# EAGLE design sboxs (EAGLE 8.6.0)
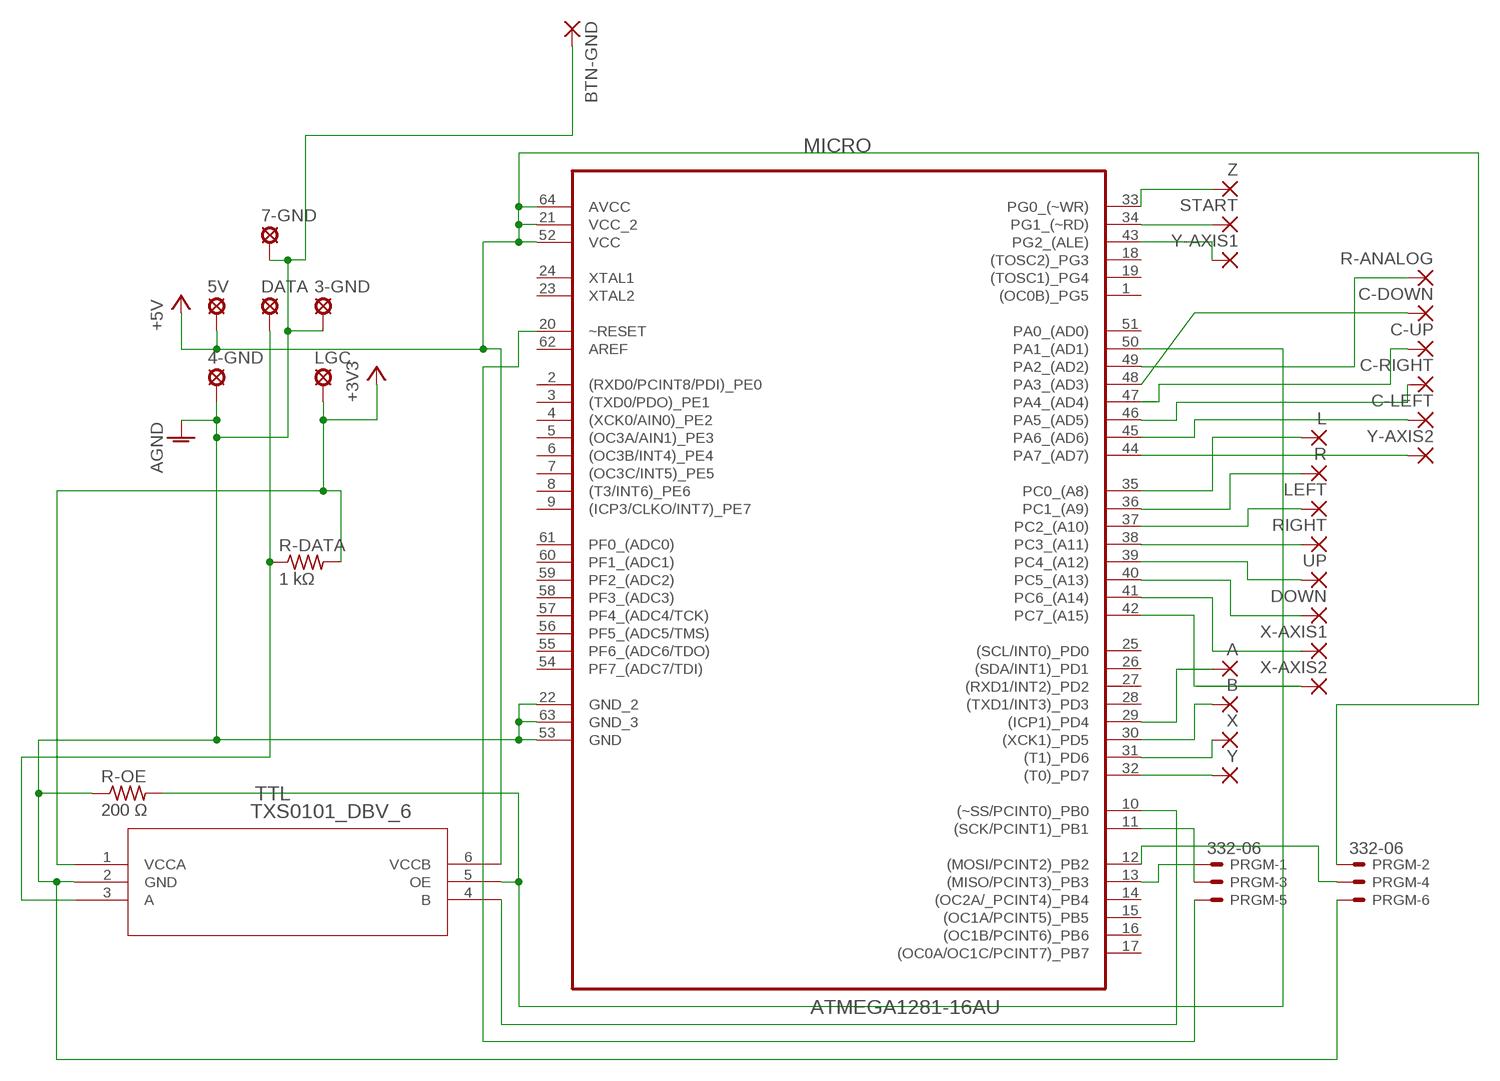
[diagram p0: schematic, sheet 1]

## Parts
3-GND  LSP10  [LSP10]
4-GND  LSP10  [LSP10]
5V  LSP10  [LSP10]
7-GND  LSP10  [LSP10]
A  1,6/0,8  [1,6/0,8]
B  1,6/0,8  [1,6/0,8]
BTN-GND  1,6/0,8  [1,6/0,8]
C-DOWN  1,6/0,8  [1,6/0,8]
C-LEFT  1,6/0,8  [1,6/0,8]
C-RIGHT  1,6/0,8  [1,6/0,8]
C-UP  1,6/0,8  [1,6/0,8]
DATA  LSP10  [LSP10]
DOWN  1,6/0,8  [1,6/0,8]
L  1,6/0,8  [1,6/0,8]
LEFT  1,6/0,8  [1,6/0,8]
LGC  LSP10  [LSP10]
MICRO  ATMEGA1281-16AU  [QFP80P1600X1600X120-64N]
PRGM  332-06  [332-06]
R  1,6/0,8  [1,6/0,8]
R-ANALOG  1,6/0,8  [1,6/0,8]
R-DATA  1 kΩ  R-US_0207/12  [0207/12]
R-OE  200 Ω  R-US_0207/12  [0207/12]
RIGHT  1,6/0,8  [1,6/0,8]
START  1,6/0,8  [1,6/0,8]
TTL  TXS0101_DBV_6  [DBV6]
UP  1,6/0,8  [1,6/0,8]
X  1,6/0,8  [1,6/0,8]
X-AXIS1  1,6/0,8  [1,6/0,8]
X-AXIS2  1,6/0,8  [1,6/0,8]
Y  1,6/0,8  [1,6/0,8]
Y-AXIS1  1,6/0,8  [1,6/0,8]
Y-AXIS2  1,6/0,8  [1,6/0,8]
Z  1,6/0,8  [1,6/0,8]

## Nets
+3V3: LGC.MP R-DATA.2 TTL.1(VCCA)
+5V: 5V.MP MICRO.21(VCC_2) MICRO.52(VCC) MICRO.64(AVCC) PRGM.2 TTL.6(VCCB)
AGND: 3-GND.MP 4-GND.MP 7-GND.MP BTN-GND.1(P) MICRO.22(GND_2) MICRO.53(GND) MICRO.63(GND_3) PRGM.6 R-OE.1 TTL.2(GND)
N$1: MICRO.32((T0)_PD7) Y.1(P)
N$2: MICRO.31((T1)_PD6) X.1(P)
N$3: B.1(P) MICRO.30((XCK1)_PD5)
N$4: A.1(P) MICRO.29((ICP1)_PD4)
N$5: MICRO.33(PG0_(~WR)) Z.1(P)
N$6: MICRO.34(PG1_(~RD)) START.1(P)
N$7: L.1(P) MICRO.35(PC0_(A8))
N$8: MICRO.36(PC1_(A9)) R.1(P)
N$9: LEFT.1(P) MICRO.37(PC2_(A10))
N$10: MICRO.38(PC3_(A11)) RIGHT.1(P)
N$11: MICRO.39(PC4_(A12)) UP.1(P)
N$12: DOWN.1(P) MICRO.40(PC5_(A13))
N$13: MICRO.41(PC6_(A14)) X-AXIS1.1(P)
N$14: MICRO.42(PC7_(A15)) X-AXIS2.1(P)
N$15: MICRO.44(PA7_(AD7)) Y-AXIS2.1(P)
N$16: C-LEFT.1(P) MICRO.45(PA6_(AD6))
N$17: C-RIGHT.1(P) MICRO.46(PA5_(AD5))
N$18: C-UP.1(P) MICRO.47(PA4_(AD4))
N$19: C-DOWN.1(P) MICRO.48(PA3_(AD3))
N$20: MICRO.49(PA2_(AD2)) R-ANALOG.1(P)
N$21: MICRO.13((MISO/PCINT3)_PB3) PRGM.1
N$22: MICRO.12((MOSI/PCINT2)_PB2) PRGM.4
N$23: MICRO.11((SCK/PCINT1)_PB1) PRGM.3
N$24: MICRO.43(PG2_(ALE)) Y-AXIS1.1(P)
N$25: MICRO.20(~RESET) PRGM.5
N$28: DATA.MP R-DATA.1 TTL.3(A)
N$29: MICRO.10((~SS/PCINT0)_PB0) TTL.4(B)
N$30: MICRO.50(PA1_(AD1)) R-OE.2 TTL.5(OE)
Unconnected: MICRO.1((OC0B)_PG5) MICRO.2((RXD0/PCINT8/PDI)_PE0) MICRO.3((TXD0/PDO)_PE1) MICRO.4((XCK0/AIN0)_PE2) MICRO.5((OC3A/AIN1)_PE3) MICRO.6((OC3B/INT4)_PE4) MICRO.7((OC3C/INT5)_PE5) MICRO.8((T3/INT6)_PE6) MICRO.9((ICP3/CLKO/INT7)_PE7) MICRO.14((OC2A/_PCINT4)_PB4) MICRO.15((OC1A/PCINT5)_PB5) MICRO.16((OC1B/PCINT6)_PB6) MICRO.17((OC0A/OC1C/PCINT7)_PB7) MICRO.18((TOSC2)_PG3) MICRO.19((TOSC1)_PG4) MICRO.23(XTAL2) MICRO.24(XTAL1) MICRO.25((SCL/INT0)_PD0) MICRO.26((SDA/INT1)_PD1) MICRO.27((RXD1/INT2)_PD2) MICRO.28((TXD1/INT3)_PD3) MICRO.51(PA0_(AD0)) MICRO.54(PF7_(ADC7/TDI)) MICRO.55(PF6_(ADC6/TDO)) MICRO.56(PF5_(ADC5/TMS)) MICRO.57(PF4_(ADC4/TCK)) MICRO.58(PF3_(ADC3)) MICRO.59(PF2_(ADC2)) MICRO.60(PF1_(ADC1)) MICRO.61(PF0_(ADC0)) MICRO.62(AREF)

## Library data of the parts
3-GND 4-GND 5V 7-GND DATA LGC = solpad:LSP10: SOLDER PAD drill 1.0 mm, distributor Buerklin, 12H555
A B BTN-GND C-DOWN C-LEFT C-RIGHT C-UP DOWN L LEFT R R-ANALOG RIGHT START UP X X-AXIS1 X-AXIS2 Y Y-AXIS1 Y-AXIS2 Z = wirepad:1,6/0,8: THROUGH-HOLE PAD
MICRO = Atmel_By_element14_Batch_1-00:ATMEGA1281-16AU: Microcontroller; DESCRIPTION: Microcontroller; MPN: ATMEGA1281-16AU; OC_FARNELL: 1455092; OC_NEWARK: 58M3721; PACKAGE: QFP-64; SUPPLIER: ATMEL
PRGM = con-garry:332-06: 6 Pin - 2mm Dual Row Source: www.mpe-connector.de / garry_shortform_2012.pdf
R-DATA R-OE = resistor:R-US_: RESISTOR, American symbol
TTL = txs0101:TXS0101_DBV_6; DATASHEETURL: httpwww.ti.comlitgpnTXS0101; FAMILY_NAME: AUTO DIRECTION SENSING DUAL SUPPLY TRANSLATOR; GENERIC_PART_NUMBER: TXS0101; INDUSTRY_STD_PKG_TYPE: SOT23; MANUFACTURER: Texas Instruments; MANUFACTURER_PART_NUMBER: txs0101_dbv_6; PACKAGE_DESIGNATOR: DBV; PIN_COUNT: 6; VENDOR: Texas Instruments

## Board
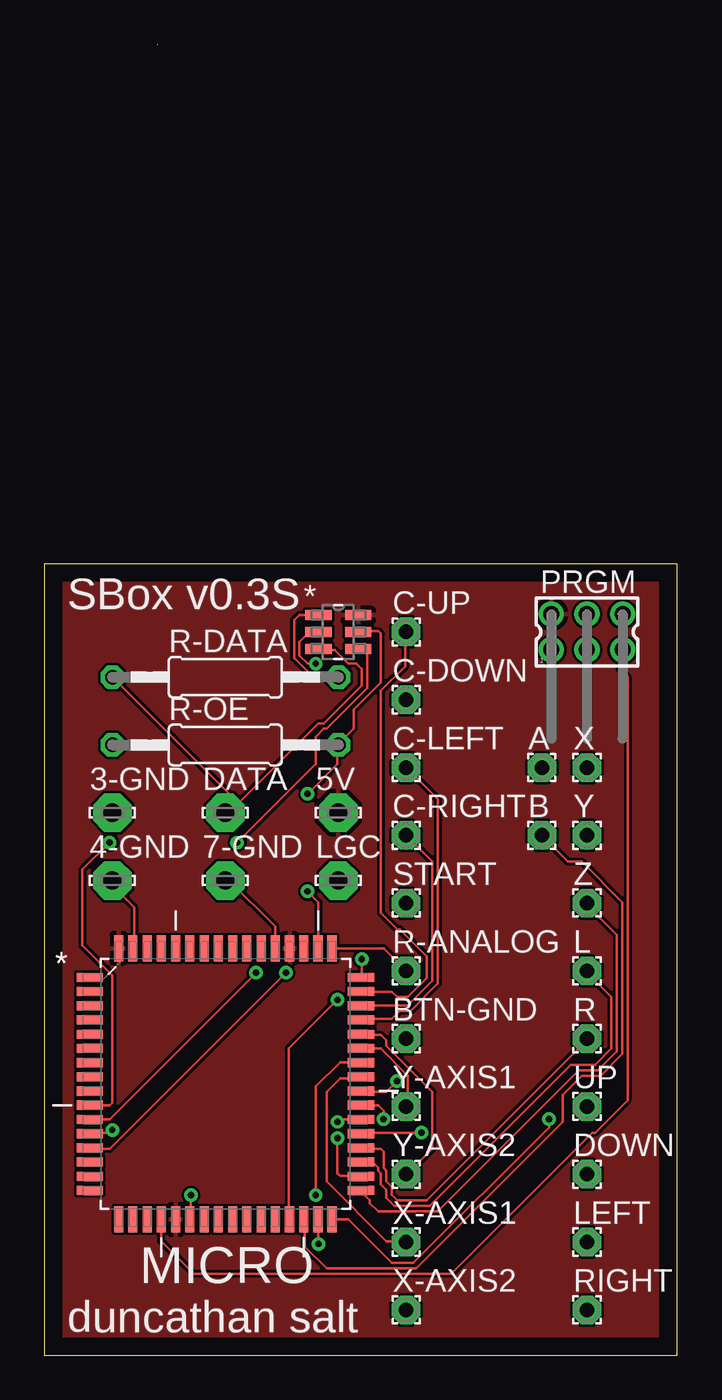
[diagram p1: board, top side]
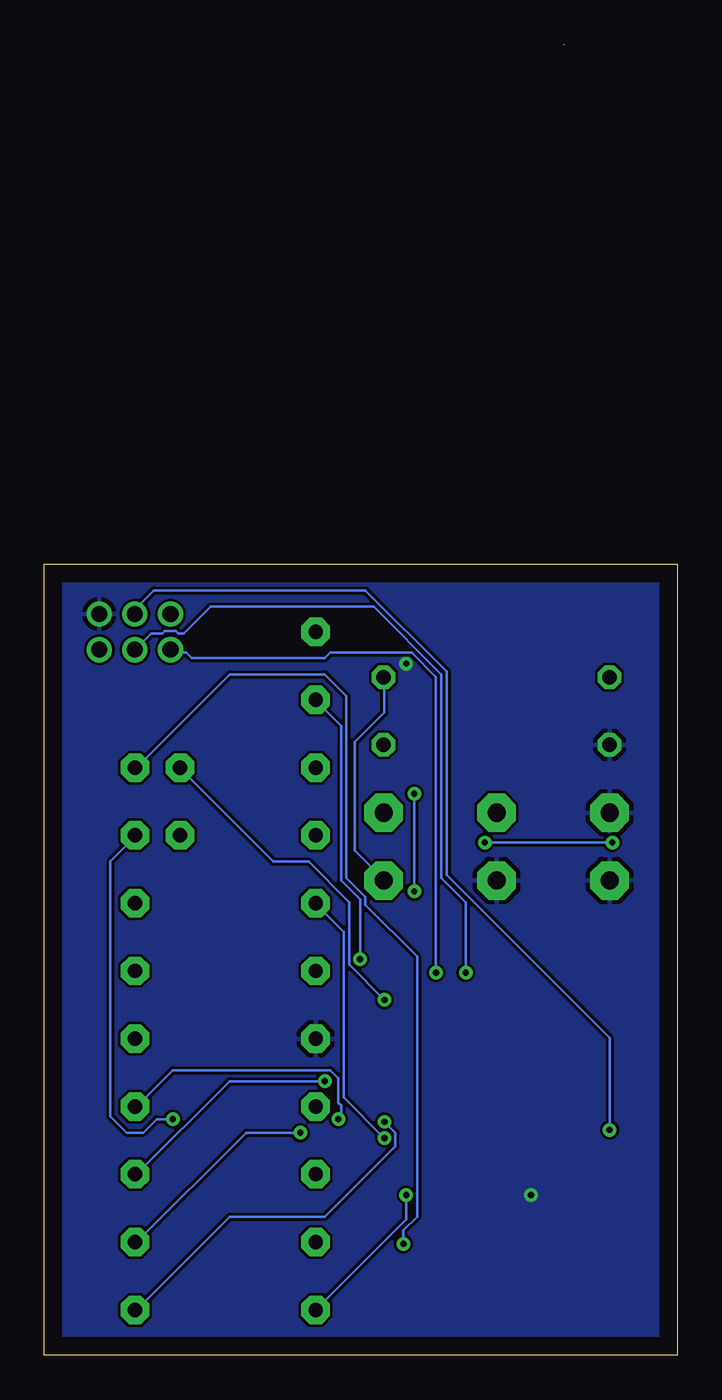
[diagram p2: board, bottom side, seen from below]

Size 35.56 x 73.66 mm. Coordinates in mm from the lower left corner, seen from the top.
Outline: 6.35,73.64 6.35,73.66
Outline: 0,0 35.56,0 35.56,44.45 0,44.45 0,0
Copper layers (1*16): Top 0.035mm / dielectric 1.5mm / Bottom 0.035mm
Design rules "default": minimum track width 6mil, minimum drill 0.35mm, track to track 6mil, track to pad 6mil, pad to pad 6mil, via to via 6mil, smd to smd 6mil, copper to edge 40mil, drill to drill 6mil, minimum pad ring 10mil, minimum via ring 8mil, stop-mask expansion 4mil, vias tented up to drill 0mil, thermal gap 10mil

### Footprints (pad centres in the part's own frame; a part is rotated, then mirrored left to right if it is on the bottom)
LSP10 = drill 1.016 pad 2.159 octagon: MP 0,0
1,6/0,8 = drill 0.813 pad 1.6 octagon: 1 0,0
QFP80P1600X1600X120-64N = smd 1.473 x 0.508: 1 -7.62,5.994; 2 -7.62,5.207; 3 -7.62,4.394; 4 -7.62,3.607; 5 -7.62,2.794; 6 -7.62,2.007; 7 -7.62,1.194; 8 -7.62,0.406; 9 -7.62,-0.406; 10 -7.62,-1.194; 11 -7.62,-2.007; 12 -7.62,-2.794; 13 -7.62,-3.607; 14 -7.62,-4.394; 15 -7.62,-5.207; 16 -7.62,-5.994; 33 7.62,-5.994; 34 7.62,-5.207; 35 7.62,-4.394; 36 7.62,-3.607; 37 7.62,-2.794; 38 7.62,-2.007; 39 7.62,-1.194; 40 7.62,-0.406; 41 7.62,0.406; 42 7.62,1.194; 43 7.62,2.007; 44 7.62,2.794; 45 7.62,3.607; 46 7.62,4.394; 47 7.62,5.207; 48 7.62,5.994 | smd 0.508 x 1.473: 17 -5.994,-7.62; 18 -5.207,-7.62; 19 -4.394,-7.62; 20 -3.607,-7.62; 21 -2.794,-7.62; 22 -2.007,-7.62; 23 -1.194,-7.62; 24 -0.406,-7.62; 25 0.406,-7.62; 26 1.194,-7.62; 27 2.007,-7.62; 28 2.794,-7.62; 29 3.607,-7.62; 30 4.394,-7.62; 31 5.207,-7.62; 32 5.994,-7.62; 49 5.994,7.62; 50 5.207,7.62; 51 4.394,7.62; 52 3.607,7.62; 53 2.794,7.62; 54 2.007,7.62; 55 1.194,7.62; 56 0.406,7.62; 57 -0.406,7.62; 58 -1.194,7.62; 59 -2.007,7.62; 60 -2.794,7.62; 61 -3.607,7.62; 62 -4.394,7.62; 63 -5.207,7.62; 64 -5.994,7.62
332-06 = drill 0.9 pad 1.27: 1 -2,-1; 2 -2,1; 3 0,-1; 4 0,1; 5 2,-1; 6 2,1
0207/12 = drill 0.813 octagon: 1 -6.35,0; 2 6.35,0
DBV6 = smd 1.473 x 0.559: 1 -1.118,0.95; 2 -1.118,0; 3 -1.118,-0.95; 4 1.118,-0.95; 5 1.118,0; 6 1.118,0.95

### Placement (x,y rotation side)
3-GND  3.81,30.48 0 top
4-GND  3.81,26.67 0 top
5V  16.51,30.48 0 top
7-GND  10.16,26.67 0 top
A  27.94,33.02 0 top
B  27.94,29.21 0 top
BTN-GND  20.32,17.78 0 top
C-DOWN  20.32,36.83 0 top
C-LEFT  20.32,33.02 0 top
C-RIGHT  20.32,29.21 0 top
C-UP  20.32,40.64 0 top
DATA  10.16,30.48 0 top
DOWN  30.48,10.16 0 top
L  30.48,21.59 0 top
LEFT  30.48,6.35 0 top
LGC  16.51,26.67 0 top
MICRO  10.16,15.24 0 top
PRGM  30.48,40.64 0 top
R  30.48,17.78 0 top
R-ANALOG  20.32,21.59 0 top
R-DATA  10.16,38.1 0 top
R-OE  10.16,34.29 0 top
RIGHT  30.48,2.54 0 top
START  20.32,25.4 0 top
TTL  16.51,40.64 0 top
UP  30.48,13.97 0 top
X  30.48,33.02 0 top
X-AXIS1  20.32,6.35 0 top
X-AXIS2  20.32,2.54 0 top
Y  30.48,29.21 0 top
Y-AXIS1  20.32,13.97 0 top
Y-AXIS2  20.32,10.16 0 top
Z  30.48,25.4 0 top

### Tracks (layer width: path | path; a pad name or v marks a point on that pad's centre or on a via)
+3V3
  Top 0.152: R-DATA.2 15.09,38.1 14.02,39.17 14.02,41.3 14.33,41.6 15.39,41.6 TTL.1
  Bottom 0.152: R-DATA.2 16.46,38.1 16.46,36.12 18.14,34.44 18.14,28.35 16.46,26.67 LGC.MP
+5V
  pour Top: 0,44.45 0,0 35.56,0 35.56,44.45
AGND  (via drill 0.35)
  Top 0.152: v8.23,8.99 8.23,7.62 MICRO.22 | 4-GND.MP 3.81,26.36 5.03,25.15 5.03,22.86 MICRO.63 | MICRO.53 12.95,24.08 10.36,26.67 7-GND.MP | v15.24,38.86 14.78,38.86 14.33,39.32 14.33,40.08 14.78,40.54 15.39,40.54 TTL.2
  pour Bottom: 0,44.45 35.56,44.45 35.56,0 0,0
N$1  (via drill 0.35)
  Top 0.152: MICRO.32 17.07,7.62 19.51,5.18 20.73,5.18 28.35,12.8 v28.35,13.26
  Bottom 0.152: v28.35,13.26 29.26,13.26 30.02,12.5 30.94,12.5 31.85,13.41 31.85,27.74 30.48,29.11 Y.1
N$2  (via drill 0.35)
  Top 0.152: v15.39,6.25 15.39,7.62 MICRO.31
  Bottom 0.152: v15.39,6.25 15.39,7.01 14.63,7.77 14.63,22.4 17.53,25.3 17.53,25.76 18.59,26.82 18.59,37.03 19.81,38.25 25.15,38.25 30.48,32.92 X.1
N$3
  Top 0.152: B.1 29.41,27.74 30.18,27.74 32.46,25.45 32.46,16.92 31.24,15.7 30.18,15.7 29.11,14.63 29.11,13.11 20.88,4.88 15.85,4.88 14.63,6.1 14.63,7.62 MICRO.30
N$4  (via drill 0.35)
  Top 0.152: v16.46,19.96 13.72,17.22 13.72,7.62 MICRO.29
  Bottom 0.152: v16.46,19.96 18.44,21.95 18.44,25.45 20.73,27.74 22.71,27.74 27.89,32.92 A.1
N$5
  Top 0.152: MICRO.33 17.83,9.14 18.29,8.69 18.29,8.53 18.75,8.08 22.1,8.08 30.02,16 31.09,16 32.16,17.07 32.16,23.62 30.48,25.3 Z.1
N$6  (via drill 0.35)
  Top 0.152: v16.46,12.19 16.46,10.21 16.61,10.06 17.68,10.06 MICRO.34
  Bottom 0.152: v16.46,12.19 18.75,14.48 18.75,23.77 20.27,25.3 START.1
N$7
  Top 0.152: MICRO.35 17.83,10.82 18.44,10.82 18.75,10.52 18.75,10.36 18.9,10.21 18.9,9.6 19.2,9.3 19.2,8.84 19.66,8.38 21.64,8.38 29.57,16.31 30.94,16.31 31.85,17.22 31.85,20.12 30.48,21.49 L.1
N$8
  Top 0.152: MICRO.36 17.83,11.58 18.9,11.58 19.05,11.43 19.05,10.52 19.2,10.36 19.2,9.75 19.51,9.45 19.51,8.99 19.81,8.69 21.49,8.69 30.48,17.68 R.1
N$9  (via drill 0.35)
  Top 0.152: v21.18,12.5 17.83,12.5 MICRO.37
  Bottom 0.152: v21.18,12.5 24.23,12.5 30.48,6.25 LEFT.1
N$10  (via drill 0.35)
  Top 0.152: v16.46,13.11 16.61,13.26 17.68,13.26 MICRO.38
  Bottom 0.152: v16.46,13.11 15.85,12.5 15.85,11.73 19.81,7.77 25.15,7.77 30.48,2.44 RIGHT.1
N$11  (via drill 0.35)
  Top 0.152: v19.05,13.26 19.05,13.72 18.75,14.02 17.83,14.02 MICRO.39
  Bottom 0.152: v19.05,13.26 18.9,13.41 18.9,14.02 19.05,14.17 19.05,15.54 19.51,16 28.35,16 30.48,13.87 UP.1
N$12  (via drill 0.35)
  Top 0.152: v19.81,15.39 19.2,14.78 17.83,14.78 MICRO.40
  Bottom 0.152: v19.81,15.39 25.15,15.39 30.48,10.06 DOWN.1
N$13
  Top 0.152: MICRO.41 17.68,15.54 16.61,15.54 15.85,14.78 15.85,9.75 19.2,6.4 20.27,6.4 X-AXIS1.1
N$14  (via drill 0.35)
  Top 0.152: v15.24,8.99 15.24,15.09 16.61,16.46 17.68,16.46 MICRO.42
  Bottom 0.152: v15.24,8.99 15.24,7.62 X-AXIS2.1
N$15
  Top 0.152: MICRO.44 17.83,17.98 18.9,17.98 19.2,17.68 19.2,17.37 21.79,14.78 21.79,11.58 20.42,10.21 Y-AXIS2.1
N$16
  Top 0.152: C-LEFT.1 22.1,31.24 22.1,20.88 20.57,19.36 19.96,19.36 19.51,18.9 17.83,18.9 MICRO.45
N$17
  Top 0.152: C-RIGHT.1 21.79,27.74 21.79,21.03 20.42,19.66 17.83,19.66 MICRO.46
N$18
  Top 0.152: MICRO.47 17.83,20.42 19.51,20.42 19.81,20.12 20.42,20.12 21.49,21.18 21.49,22.4 19.96,23.93 19.81,23.93 18.9,24.84 18.9,37.34 20.27,38.71 20.27,40.54 C-UP.1
N$19  (via drill 0.35)
  Top 0.152: v17.83,22.25 17.83,21.34 MICRO.48
  Bottom 0.152: v17.83,22.25 17.83,25.6 18.9,26.67 18.9,35.36 20.27,36.73 C-DOWN.1
N$20
  Top 0.152: MICRO.49 19.05,22.86 R-ANALOG.1
N$21  (via drill 0.35)
  Top 0.152: v13.56,21.49 3.66,11.58 2.59,11.58 MICRO.13
  Bottom 0.152: v13.56,21.49 13.56,38.1 14.94,39.47 19.51,39.47 19.81,39.17 27.28,39.17 27.58,39.47 28.19,39.47 28.35,39.62 PRGM.1
N$22  (via drill 0.35)
  Top 0.152: v3.81,12.65 3.66,12.5 2.59,12.5 MICRO.12
  Bottom 0.152: v3.81,12.65 3.81,17.83 12.95,26.98 12.95,38.41 17.53,42.98 29.41,42.98 30.48,41.91 PRGM.4
N$23  (via drill 0.35)
  Top 0.152: v11.89,21.49 3.66,13.26 2.59,13.26 MICRO.11
  Bottom 0.152: v11.89,21.49 11.89,25.45 13.26,26.82 13.26,38.25 17.07,42.06 26.21,42.06 27.74,40.54 28.04,40.54 28.19,40.69 28.8,40.69 28.96,40.54 29.57,40.54 30.48,39.62 PRGM.3
N$24
  Top 0.152: MICRO.43 17.83,17.22 18.9,17.22 20.42,15.7 20.42,14.02 Y-AXIS1.1
N$25
  Top 0.152: MICRO.20 6.55,6.4 8.38,4.57 22.86,4.57 30.79,12.5 30.94,12.5 32.77,14.33 32.77,38.1 32.31,38.56 32.31,38.86 32.46,39.01 32.46,39.62 PRGM.5
N$28
  Top 0.152: 10.97,31.09 10.36,30.48 DATA.MP 10.97,31.09 | 10.97,31.09 15.39,35.51 15.7,35.51 17.83,37.64 17.83,38.56 17.53,38.86 17.07,38.86 16.31,39.62 15.39,39.62 TTL.3 | R-DATA.1 10.82,31.09 10.97,31.09
N$29  (via drill 0.35)
  Top 0.152: v3.66,28.8 2.13,27.28 2.13,23.01 3.81,21.34 3.81,14.17 3.66,14.02 2.59,14.02 MICRO.10 | v10.82,28.8 15.24,33.22 15.24,34.75 15.7,35.2 15.85,35.2 18.14,37.49 18.14,39.47 17.98,39.62 17.68,39.62 TTL.4
  Bottom 0.152: v10.82,28.8 v3.66,28.8
N$30  (via drill 0.35)
  Top 0.152: v14.78,26.06 15.39,25.45 15.39,22.86 MICRO.50 | v14.78,31.55 16.46,33.22 16.46,34.29 | 16.46,34.29 17.37,35.2 17.37,36.27 18.9,37.8 18.9,40.54 18.75,40.69 17.68,40.69 TTL.5 | 16.46,34.29 R-OE.2
  Bottom 0.152: v14.78,31.55 v14.78,26.06

### Text on the board
tNames: SBox v0.3S | duncathan salt